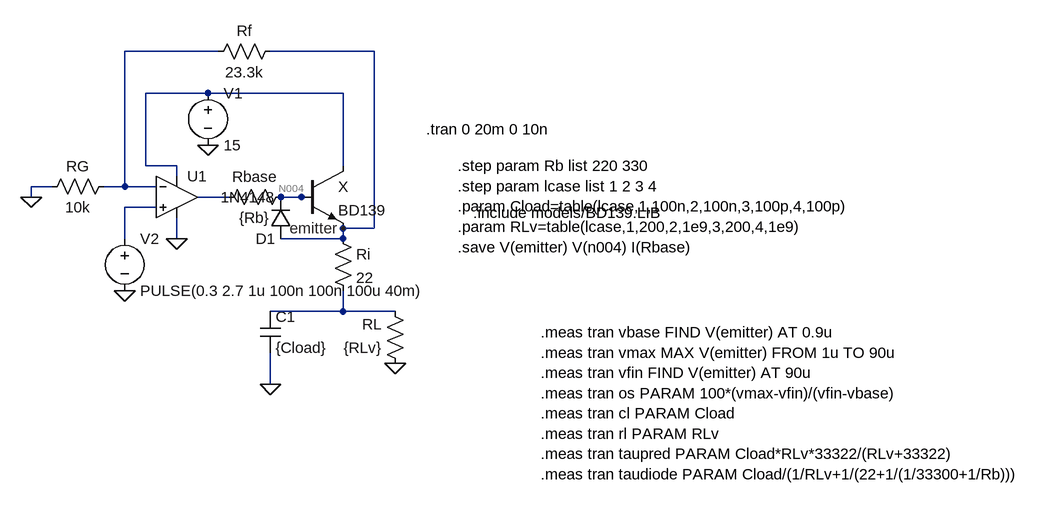
[diagram p0: schematic 09_sweep_source_clamped.asc]
09_sweep_source_clamped.asc, the LTspice schematic file:
Version 4.1
SHEET 1 1460 680
WIRE 320 -32 176 -32
WIRE 560 -32 400 -32
WIRE 304 32 208 32
WIRE 512 32 304 32
WIRE 208 144 208 32
WIRE 256 144 208 144
WIRE 512 144 512 32
WIRE 256 160 256 144
WIRE 64 176 32 176
WIRE 176 176 176 -32
WIRE 176 176 144 176
WIRE 224 176 176 176
WIRE 32 192 32 176
WIRE 336 192 288 192
WIRE 448 192 416 192
WIRE 464 192 448 192
WIRE 224 208 176 208
WIRE 560 240 560 -32
WIRE 560 240 512 240
WIRE 176 256 176 208
WIRE 256 256 256 224
WIRE 512 256 512 240
WIRE 512 368 512 336
WIRE 512 368 400 368
WIRE 592 368 512 368
WIRE 400 480 400 432
WIRE 512 256 416 256
FLAG 176 336 0
FLAG 32 192 0
FLAG 592 448 0
FLAG 256 256 0
FLAG 304 112 0
FLAG 400 480 0
FLAG 512 240 emitter
SYMBOL OpAmps\\UniversalOpAmp2 256 192 R0
SYMATTR InstName U1
SYMBOL voltage 176 240 R0
WINDOW 123 0 0 Left 0
WINDOW 39 0 0 Left 0
SYMATTR InstName V2
SYMATTR Value PULSE(0.3 2.7 1u 100n 100n 100u 40m)
SYMBOL res 160 160 R90
WINDOW 0 0 56 VBottom 2
WINDOW 3 32 56 VTop 2
SYMATTR InstName RG
SYMATTR Value 10k
SYMBOL npn 448 144 R0
SYMATTR InstName X
SYMATTR Value BD139
SYMATTR Prefix X
SYMBOL diode 432 256 R180
SYMATTR InstName D1
SYMATTR Value 1N4148
SYMBOL res 416 -48 R90
WINDOW 0 0 56 VBottom 2
WINDOW 3 32 56 VTop 2
SYMATTR InstName Rf
SYMATTR Value 23.3k
SYMBOL res 608 464 R180
WINDOW 0 36 76 Left 2
WINDOW 3 36 40 Left 2
SYMATTR InstName RL
SYMATTR Value {RLv}
SYMBOL voltage 304 16 R0
SYMATTR InstName V1
SYMATTR Value 15
SYMBOL res 432 176 R90
WINDOW 0 0 56 VBottom 2
WINDOW 3 32 56 VTop 2
SYMATTR InstName Rbase
SYMATTR Value {Rb}
SYMBOL cap 384 368 R0
SYMATTR InstName C1
SYMATTR Value {Cload}
SYMBOL res 496 240 R0
SYMATTR InstName Ri
SYMATTR Value 22
TEXT 640 88 Left 2 !.tran 0 20m 0 10n
TEXT 712 216 Left 2 !.include models/BD139.LIB
TEXT 688 144 Left 2 !.step param Rb list 220 330\n.step param lcase list 1 2 3 4\n.param Cload=table(lcase,1,100n,2,100n,3,100p,4,100p)\n.param RLv=table(lcase,1,200,2,1e9,3,200,4,1e9)\n.save V(emitter) V(n004) I(Rbase)
TEXT 816 400 Left 2 !.meas tran vbase FIND V(emitter) AT 0.9u\n.meas tran vmax MAX V(emitter) FROM 1u TO 90u\n.meas tran vfin FIND V(emitter) AT 90u\n.meas tran os PARAM 100*(vmax-vfin)/(vfin-vbase)\n.meas tran cl PARAM Cload\n.meas tran rl PARAM RLv\n.meas tran taupred PARAM Cload*RLv*33322/(RLv+33322)\n.meas tran taudiode PARAM Cload/(1/RLv+1/(22+1/(1/33300+1/Rb)))

The netlist it stands for:
* 09_sweep_source_clamped.asc
X§U1 N005 N001 N002 0 N003 level2 Avol=1Meg GBW=10Meg Slew=10Meg Ilimit=25m Rail=0 Vos=0 En=0 Enk=0 In=0 Ink=0 Rin=500Meg  ; pins In+ In- V+ V- OUT
V2 N005 0 PULSE(0.3 2.7 1u 100n 100n 100u 40m)
RG N001 0 10k
X§X N002 N004 emitter BD139  ; pins C B E
D1 emitter N004 1N4148
Rf emitter N001 23.3k
RL 0 N006 {RLv}
V1 N002 0 15
Rbase N004 N003 {Rb}
C1 N006 0 {Cload}
Ri emitter N006 22
.model D D
.lib standard.dio
.tran 0 20m 0 10n
.include models/BD139.LIB
.step param Rb list 220 330
.step param lcase list 1 2 3 4
.param Cload=table(lcase,1,100n,2,100n,3,100p,4,100p)
.param RLv=table(lcase,1,200,2,1e9,3,200,4,1e9)
.save V(emitter) V(n004) I(Rbase)
.meas tran vbase FIND V(emitter) AT 0.9u
.meas tran vmax MAX V(emitter) FROM 1u TO 90u
.meas tran vfin FIND V(emitter) AT 90u
.meas tran os PARAM 100*(vmax-vfin)/(vfin-vbase)
.meas tran cl PARAM Cload
.meas tran rl PARAM RLv
.meas tran taupred PARAM Cload*RLv*33322/(RLv+33322)
.meas tran taudiode PARAM Cload/(1/RLv+1/(22+1/(1/33300+1/Rb)))
.lib UniversalOpAmp2.lib
.backanno
.end